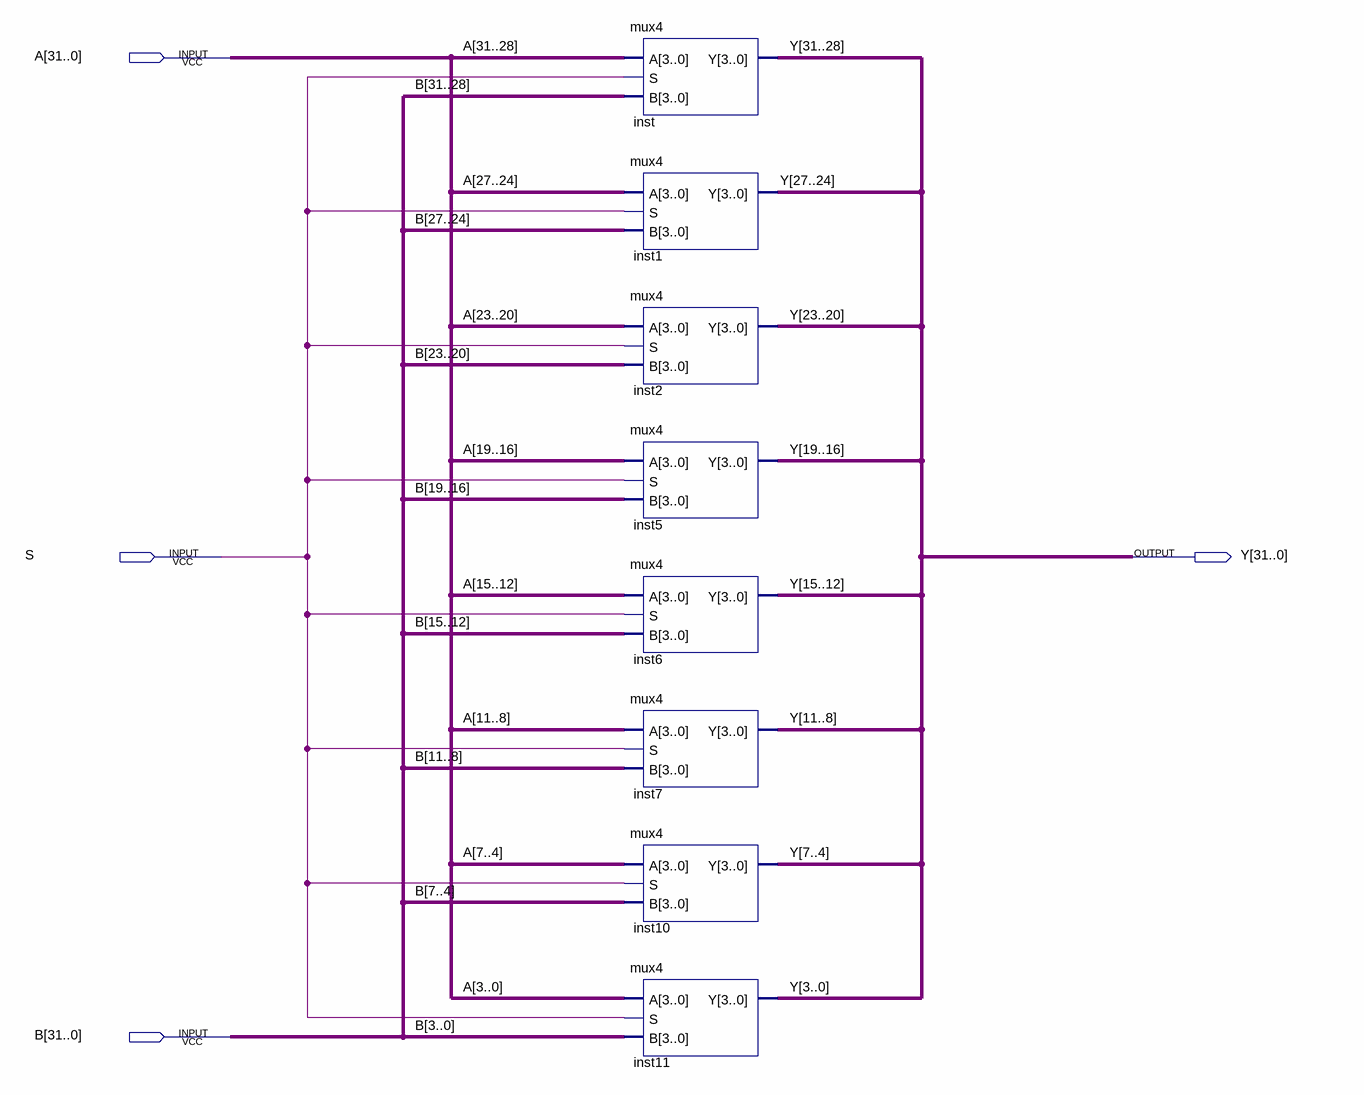
[diagram p0: schematic sheet]
// Quartus schematic mux32.bdf as structural Verilog: 8 symbols, 4 pins
module mux32 (
  input  [31:0] A,
  input  S,
  input  [31:0] B,
  output [31:0] Y
);

  mux4 inst (.A(A[31:28]), .S(S), .B(B[31:28]), .Y(Y[31:28]));
  mux4 inst1 (.A(A[27:24]), .S(S), .B(B[27:24]), .Y(Y[27:24]));
  mux4 inst2 (.A(A[23:20]), .S(S), .B(B[23:20]), .Y(Y[23:20]));
  mux4 inst5 (.A(A[19:16]), .S(S), .B(B[19:16]), .Y(Y[19:16]));
  mux4 inst6 (.A(A[15:12]), .S(S), .B(B[15:12]), .Y(Y[15:12]));
  mux4 inst7 (.A(A[11:8]), .S(S), .B(B[11:8]), .Y(Y[11:8]));
  mux4 inst10 (.A(A[7:4]), .S(S), .B(B[7:4]), .Y(Y[7:4]));
  mux4 inst11 (.A(A[3:0]), .S(S), .B(B[3:0]), .Y(Y[3:0]));
endmodule
